# EasyEDA Pro project YuriPre.eprj

# Schematic PCB_PCB_A100C_2 copy_2022-05-16/SCH_103c6t6a_YoriPre_2022-05-16

## Sheets
1 MAIN_PART
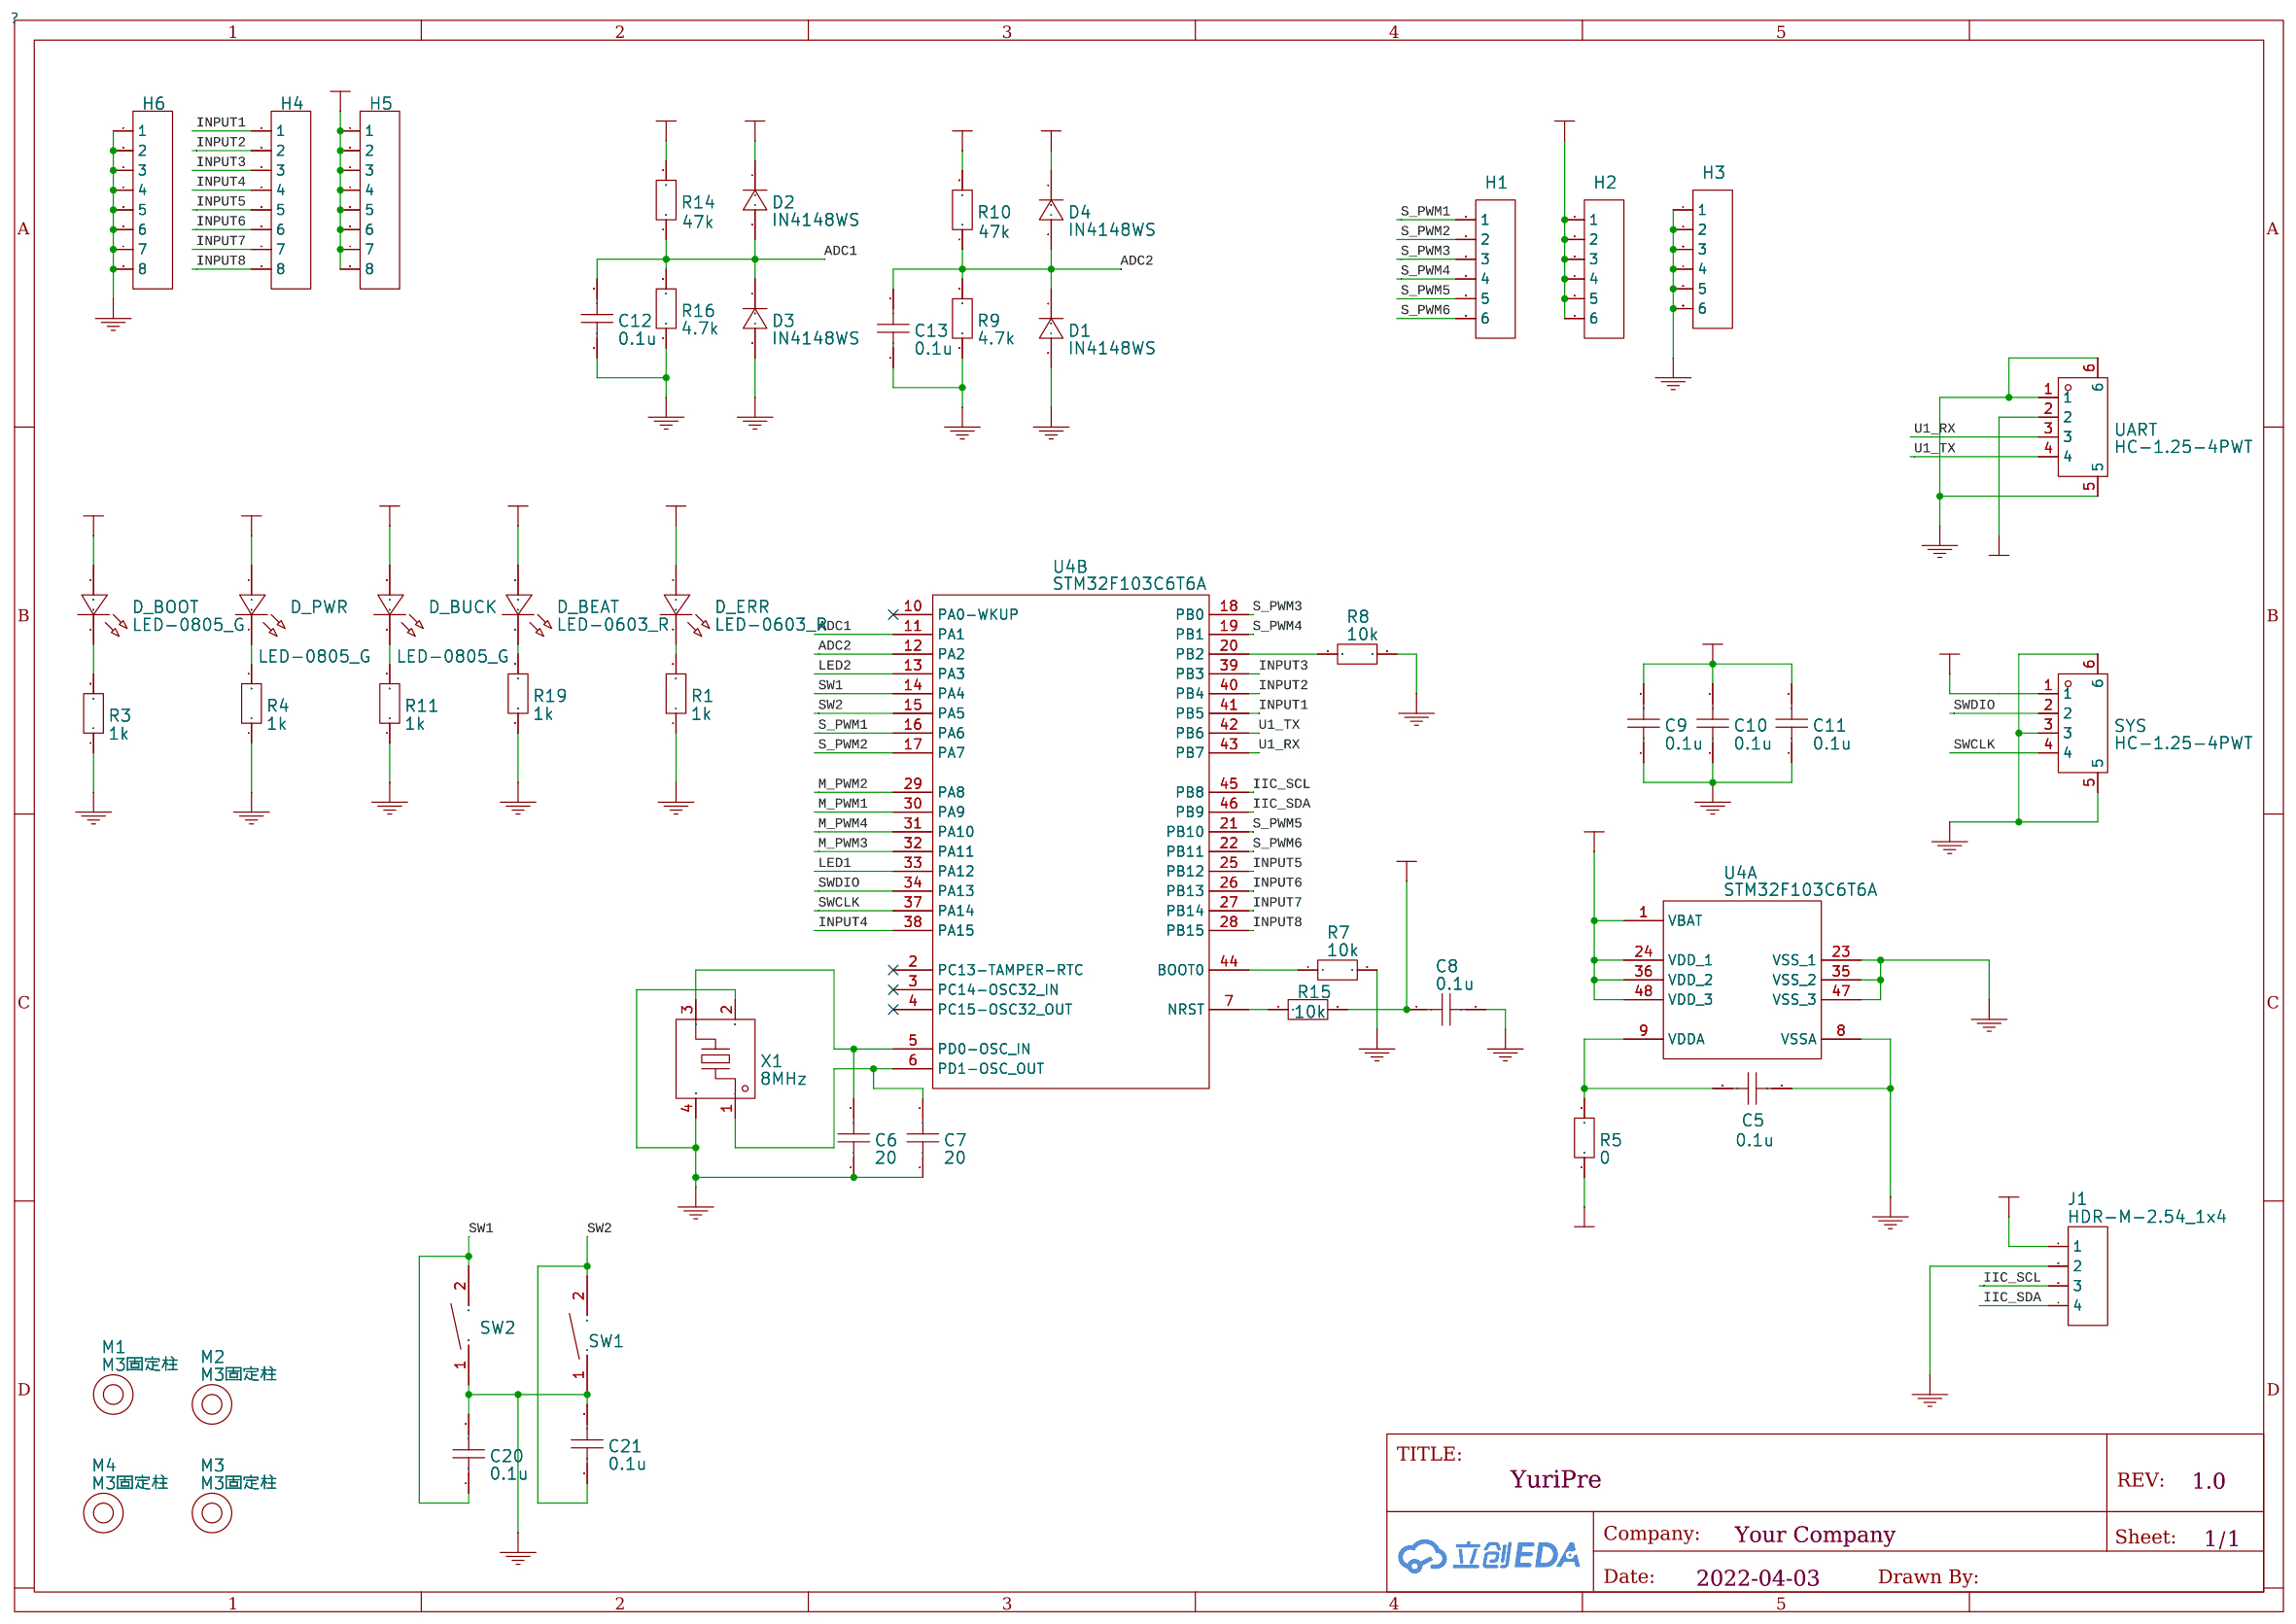
[diagram p0: MAIN_PART]
2 PWR_PART
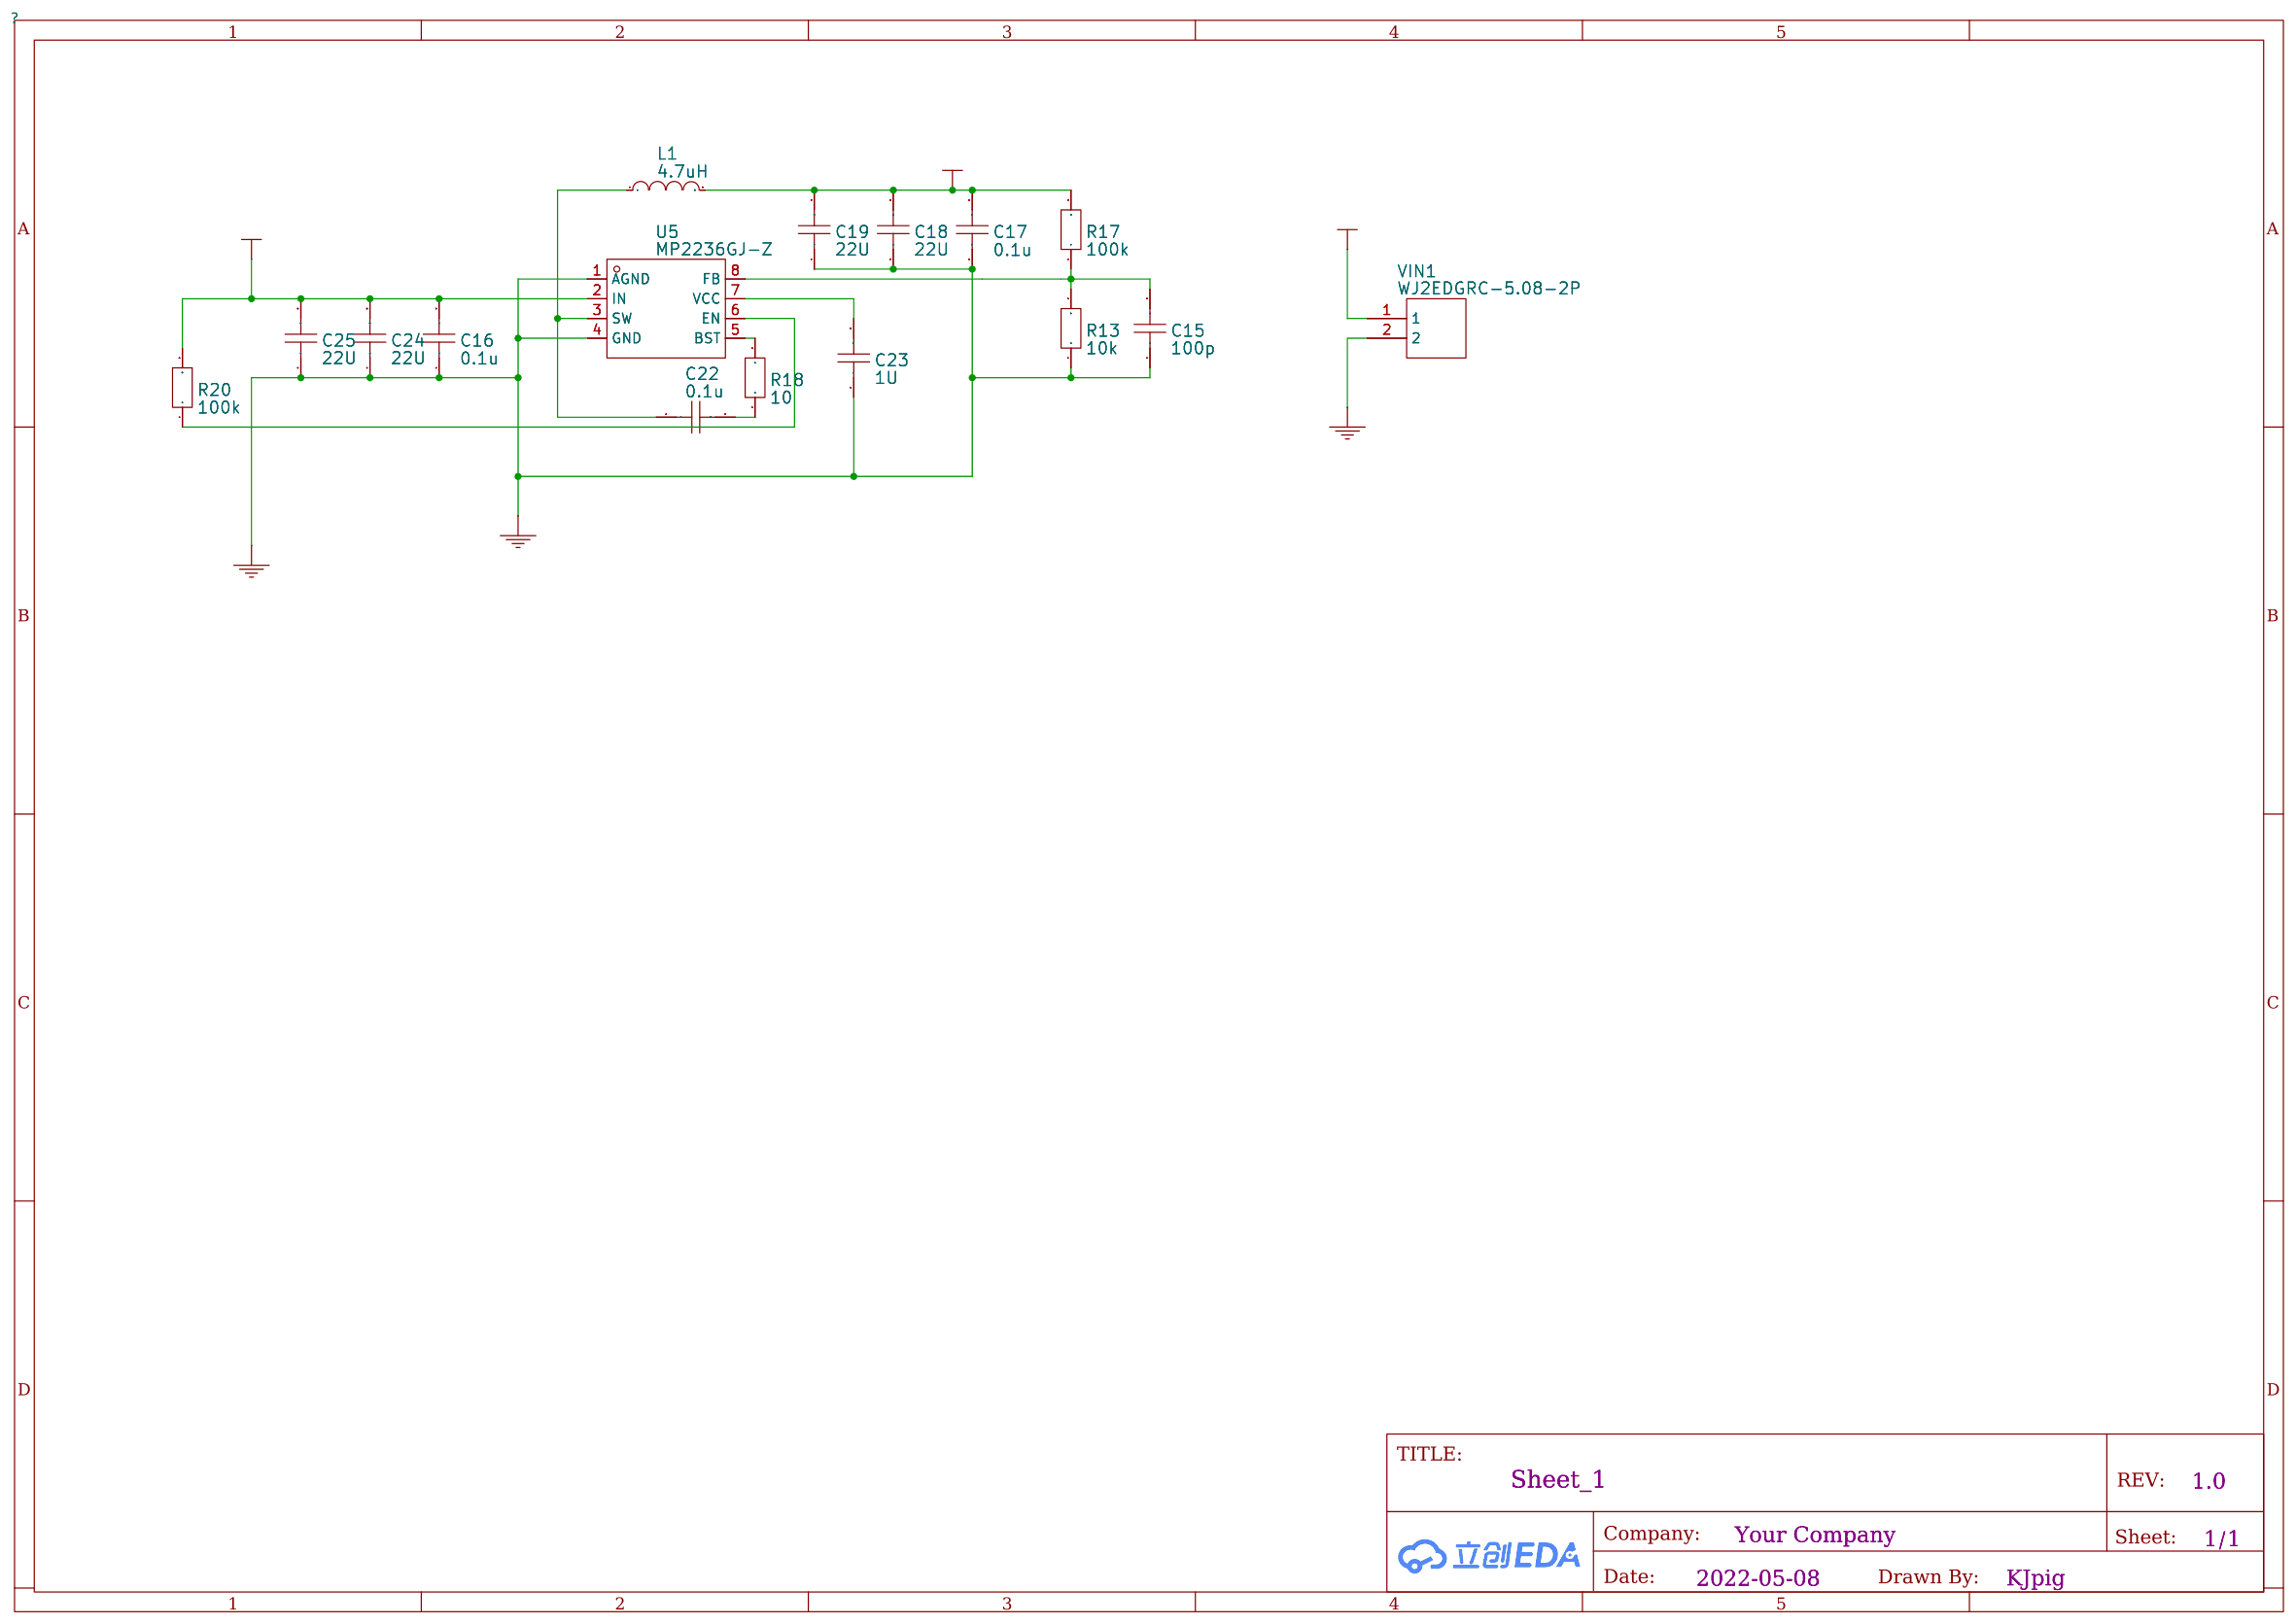
[diagram p1: PWR_PART]
3 MOTOR_PART
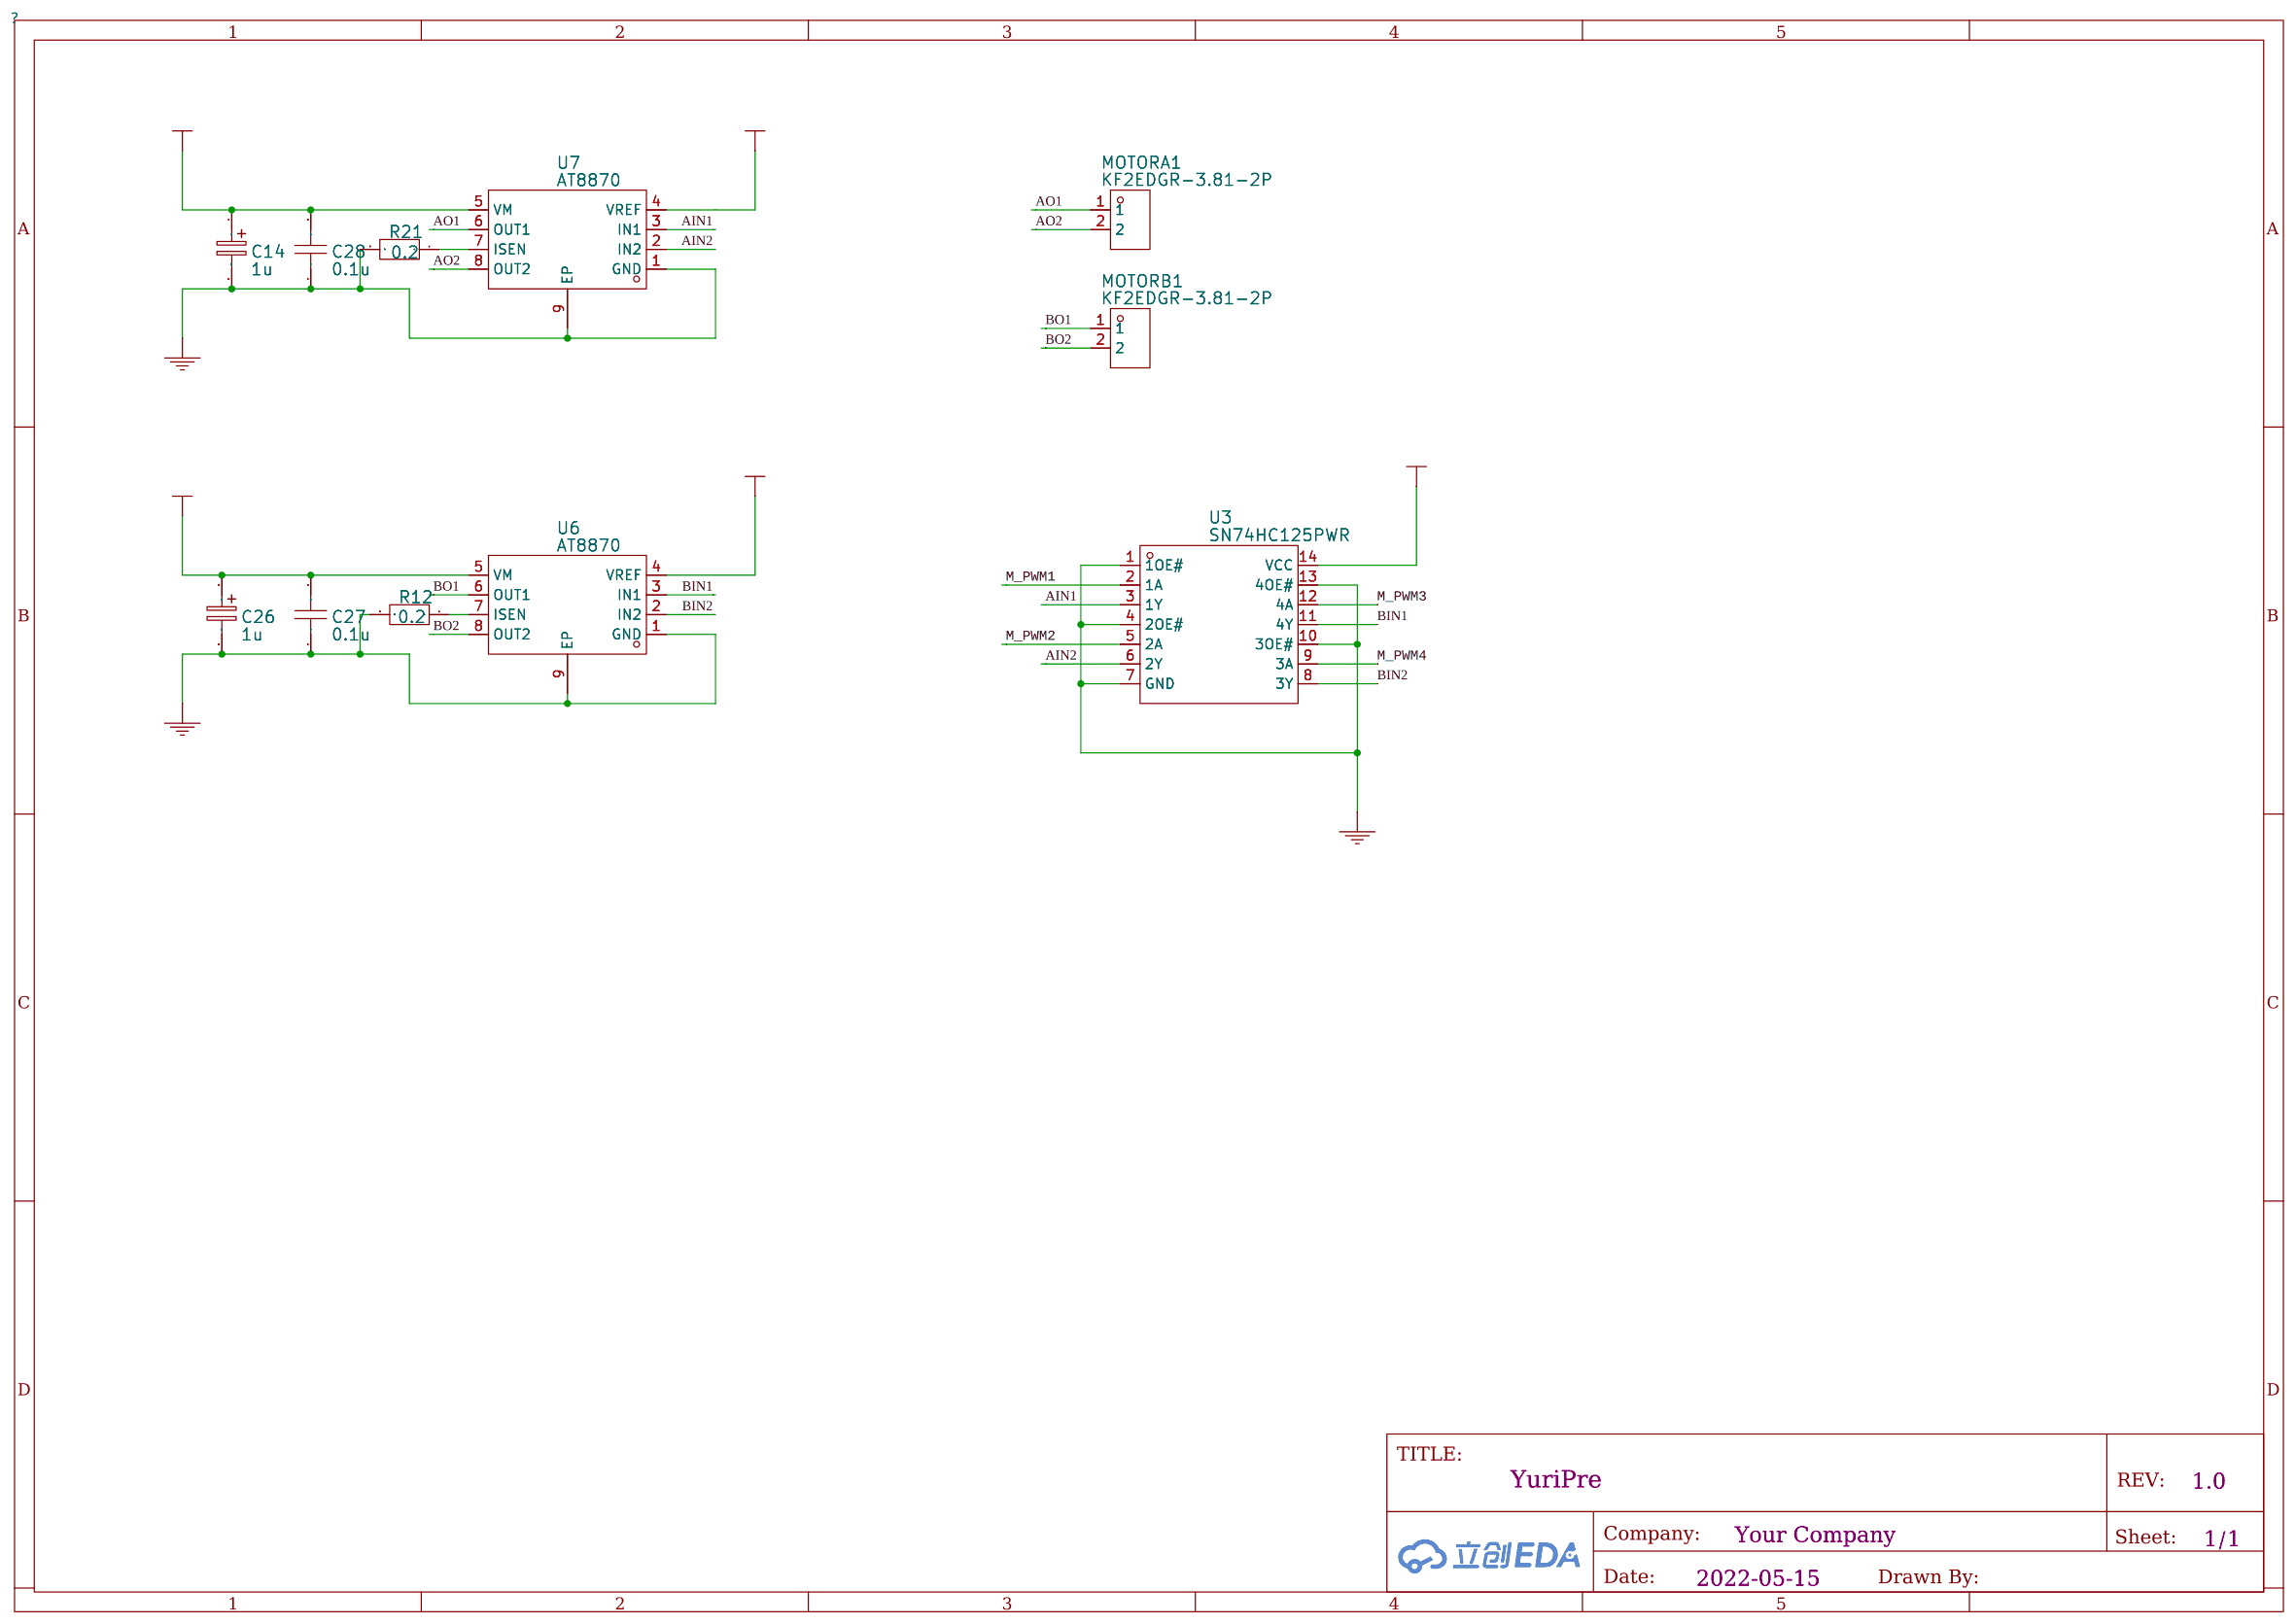
[diagram p2: MOTOR_PART]

## Parts
sheet MAIN_PART
C5  0.1u  [C0603]
C6  20  [C0603]
C7  20  [C0603]
C8  0.1u  [C0603]
C9  0.1u  [C0603]
C10  0.1u  [C0603]
C11  0.1u  [C0603]
C12  0.1u  [C0603]
C13  0.1u  [C0603]
C20  0.1u  [C0603]
C21  0.1u  [C0603]
D1  IN4148WS  [SOD-323_L1.8-W1.3-LS2.5-RD]
D2  IN4148WS  [SOD-323_L1.8-W1.3-LS2.5-RD]
D3  IN4148WS  [SOD-323_L1.8-W1.3-LS2.5-RD]
D4  IN4148WS  [SOD-323_L1.8-W1.3-LS2.5-RD]
D_BEAT  LED-0603_R  [LED0603_RED]
D_BOOT  LED-0805_G  [LED0805_GREEN]
D_BUCK  LED-0805_G  [LED0805_GREEN]
D_ERR  LED-0603_R  [LED0603_RED]
D_PWR  LED-0805_G  [LED0805_GREEN]
H1  HDR-F-2.54_1x6  [HDR-F-2.54_1X6]
H2  HDR-F-2.54_1x6  [HDR-F-2.54_1X6]
H3  HDR-F-2.54_1x6  [HDR-F-2.54_1X6]
H4  HDR-F-2.54_1x8  [HDR-F-2.54_1X8]
H5  HDR-F-2.54_1x8  [HDR-F-2.54_1X8]
H6  HDR-F-2.54_1x8  [HDR-F-2.54_1X8]
J1  HDR-M-2.54_1x4  [HDR-M-2.54_1X4]
M1  M3固定柱  [M3螺丝孔外直径6MM-带8小孔]
M2  M3固定柱  [M3螺丝孔外直径6MM-带8小孔]
M3  M3固定柱  [M3螺丝孔外直径6MM-带8小孔]
M4  M3固定柱  [M3螺丝孔外直径6MM-带8小孔]
R1  1k  [R0603]
R3  1k  [R0603]
R4  1k  [R0603]
R5  0  [R0603]
R7  10k  [R0603]
R8  10k  [R0603]
R9  4.7k  [R0603]
R10  47k  [R0603]
R11  1k  [R0603]
R14  47k  [R0603]
R15  10k  [R0603]
R16  4.7k  [R0603]
R19  1k  [R0603]
SW1  TSA343G00D-250J2  [SW-SMD_L4.0-W2.9-P4.15-EH]
SW2  TSA343G00D-250J2  [SW-SMD_L4.0-W2.9-P4.15-EH]
SYS  HC-1.25-4PWT  [CONN-SMD_4P-P1.25-HC-1.25-4PWT]
U4  STM32F103C6T6A  [LQFP-48_L7.0-W7.0-P0.50-LS9.0-BL]  (sections 1,2)
UART  HC-1.25-4PWT  [CONN-SMD_4P-P1.25-HC-1.25-4PWT]
X1  8MHz  [CRYSTAL-SMD_4P-L3.2-W2.5-BL]
sheet MOTOR_PART
C14  1u  [CAP-D6.3×H5.5]
C26  1u  [CAP-D6.3×H5.5]
C27  0.1u  [C0603]
C28  0.1u  [C0603]
MOTORA1  KF2EDGR-3.81-2P  [CONN-TH_2P-P3.81_KF2EDGR-3.81-2P]
MOTORB1  KF2EDGR-3.81-2P  [CONN-TH_2P-P3.81_KF2EDGR-3.81-2P]
R12  0.2  [R0603]
R21  0.2  [R0603]
U3  SN74HC125PWR  [TSSOP-14_L5.0-W4.4-P0.65-LS6.5-BL]
U6  AT8870  [SO-8_L4.9-W3.9-P1.27-LS6.0-BL-EP]
U7  AT8870  [SO-8_L4.9-W3.9-P1.27-LS6.0-BL-EP]
sheet PWR_PART
C15  100p  [C0603]
C16  0.1u  [C0603]
C17  0.1u  [C0603]
C18  22U  [C0805]
C19  22U  [C0805]
C22  0.1u  [C0603]
C23  1U  [C0603]
C24  22U  [C0805]
C25  22U  [C0805]
L1  4.7uH  [IND-SMD_L7.1-W6.5]
R13  10k  [R0603]
R17  100k  [R0603]
R18  10  [R0603]
R20  100k  [R0603]
U5  MP2236GJ-Z  [TSOT-23-8_L2.9-W1.6-P0.65-LS2.8-BL]
VIN1  WJ2EDGRC-5.08-2P  [CONN-TH_2P-P5.08_WJ2EDGRC-5.08-2P]

## Library data of the parts
C5 C8-C13 C16 C17 C20-C22 C27 C28 = 0.1u
C6 C7 = 20
D1-D4 = IN4148WS: Supplier: LCSC; Supplier Part: C417545; Manufacturer: Leshan Radio; JLCPCB Part Class: Extended Part
D_BEAT D_ERR = LED-0603_R: Manufacturer: EVERLIGHT(台湾亿光); Manufacturer Part: 19-217/R6C-AL1M2VY/3T; Supplier Part: C72044; Supplier: LCSC
D_BOOT D_BUCK D_PWR = LED-0805_G: Manufacturer: 国星光电; Manufacturer Part: NCD0805G1; Supplier Part: C84260
H1-H3 = HDR-F-2.54_1x6: Supplier Part: C40877; Supplier: LCSC
H4-H6 = HDR-F-2.54_1x8: Supplier Part: C225505; Supplier: LCSC
J1 = HDR-M-2.54_1x4: Supplier Part: C124378; Supplier: LCSC
M1-M4 = M3固定柱
R1 R3 R4 R11 R19 = 1k
R5 = 0_
R7 R8 R13 R15 = 10k
R9 R16 = 4.7k
R10 R14 = 47k
SW1 SW2 = TSA343G00D-250J2: Supplier: LCSC; Supplier Part: C354947; Manufacturer: BRIGHT; JLCPCB Part Class: Extended Part
SYS UART = HC-1.25-4PWT: Supplier: LCSC; Supplier Part: C2845381; Manufacturer: HCTL(华灿天禄); JLCPCB Part Class: Extended Part
U4 = STM32F103C6T6A: tags: STM32; Supplier Part: C8303; Supplier: LCSC; Manufacturer: ST; JLCPCB Part Class: Extended Part
X1 = 8MHz: Supplier: LCSC; Supplier Part: C2682774; Manufacturer: YXC扬兴科技; Manufacturer Part: X32258MSB4SI; JLCPCB Part Class: Extended Part
C14 C26 = 1u
MOTORA1 MOTORB1 = KF2EDGR-3.81-2P: Supplier: LCSC; Supplier Part: C441182; Manufacturer: Cixi Kefa Elec; JLCPCB Part Class: Extended Part
R12 R21 = 0.2
U3 = SN74HC125PWR: Supplier: LCSC; Supplier Part: C132994; Manufacturer: Texas Instruments; JLCPCB Part Class: Extended Part
U6 U7 = AT8870: Supplier: LCSC; Supplier Part: C191458; Manufacturer: Jiaxing Heroic Elec Tech; JLCPCB Part Class: Extended Part
C15 = 100p
C18 C19 C24 C25 = 22U
C23 = 1U
L1 = 4.7uH: Supplier: LCSC; Manufacturer: TDK; Manufacturer Part: SPM6530T-4R7M; Supplier Part: C76857; JLCPCB Part Class: Extended Part
R17 R20 = 100k
R18 = 10
U5 = MP2236GJ-Z: Supplier: LCSC; Supplier Part: C9900000708; Manufacturer: null; JLCPCB Part Class: Extended Part
VIN1 = WJ2EDGRC-5.08-2P: Supplier: LCSC; Manufacturer: ReliaPro; Supplier Part: C3697; JLCPCB Part Class: Extended Part

## Nets
3V3: C8.1 C9.2 C10.2 C11.2 D2.1(C) D4.1(C) D_BEAT.1 D_BOOT.1 D_ERR.1 H5.1 H5.2 H5.3 H5.4 H5.5 H5.6 H5.7 H5.8 J1.1 R5.1 R15.2 SYS.1 U3.14(VCC) U4.1(VBAT) U4.24(VDD_1) U4.36(VDD_2) U4.48(VDD_3) U6.4(VREF) U7.4(VREF) UART.2
+6.8V: C17.2 C18.2 C19.2 D_BUCK.1 H2.1 H2.2 H2.3 H2.4 H2.5 H2.6 L1.2 R10.2 R17.2
GND: C5.2 C6.1 C7.1 C8.2 C9.1 C10.1 C11.1 C12.1 C13.1 C14.2 C15.1 C16.1 C17.1 C18.1 C19.1 C20.2 C21.2 C23.1 C24.1 C25.1 C26.2 C27.1 C28.1 D1.2(A) D3.2(A) H3.1 H3.2 H3.3 H3.4 H3.5 H3.6 H6.1 H6.2 H6.3 H6.4 H6.5 H6.6 H6.7 H6.8 J1.2 R3.1 R4.1 R7.2 R8.2 R9.1 R11.1 R12.2 R13.1 R16.1 R21.2 SW1.1 SW2.1 SYS.3 SYS.5 SYS.6 U3.1(1OE#) U3.4(2OE#) U3.7(GND) U3.10(3OE#) U3.13(4OE#) U4.8(VSSA) U4.23(VSS_1) U4.35(VSS_2) U4.47(VSS_3) U5.1(AGND) U5.4(GND) U6.1(GND) U6.9(EP) U7.1(GND) U7.9(EP) UART.1 UART.5 UART.6 VIN1.2 X1.2(GND) X1.4(GND)
VIN: C14.1 C16.2 C24.2 C25.2 C26.1 C27.2 C28.2 D_PWR.1 R14.2 R20.2 U5.2(IN) U6.5(VM) U7.5(VM) VIN1.1
ADC1: C12.2 D2.2(A) D3.1(C) R14.1 R16.2 U4.11(PA1)
ADC2: C13.2 D1.1(C) D4.2(A) R9.2 R10.1 U4.12(PA2)
AIN1: U3.3(1Y) U7.3(IN1)
AIN2: U3.6(2Y) U7.2(IN2)
AO1: MOTORA1.1 U7.6(OUT1)
AO2: MOTORA1.2 U7.8(OUT2)
BIN1: U3.11(4Y) U6.3(IN1)
BIN2: U3.8(3Y) U6.2(IN2)
BO1: MOTORB1.1 U6.6(OUT1)
BO2: MOTORB1.2 U6.8(OUT2)
IIC_SCL: J1.3 U4.45(PB8)
IIC_SDA: J1.4 U4.46(PB9)
INPUT1: H4.1 U4.41(PB5)
INPUT2: H4.2 U4.40(PB4)
INPUT3: H4.3 U4.39(PB3)
INPUT4: H4.4 U4.38(PA15)
INPUT5: H4.5 U4.25(PB12)
INPUT6: H4.6 U4.26(PB13)
INPUT7: H4.7 U4.27(PB14)
INPUT8: H4.8 U4.28(PB15)
LED1: R19.1 U4.33(PA12)
LED2: R1.1 U4.13(PA3)
M_PWM1: U3.2(1A) U4.30(PA9)
M_PWM2: U3.5(2A) U4.29(PA8)
M_PWM3: U3.12(4A) U4.32(PA11)
M_PWM4: U3.9(3A) U4.31(PA10)
S_PWM1: H1.1 U4.16(PA6)
S_PWM2: H1.2 U4.17(PA7)
S_PWM3: H1.3 U4.18(PB0)
S_PWM4: H1.4 U4.19(PB1)
S_PWM5: H1.5 U4.21(PB10)
S_PWM6: H1.6 U4.22(PB11)
SW1: C20.1 SW2.2 U4.14(PA4)
SW2: C21.1 SW1.2 U4.15(PA5)
SWCLK: SYS.4 U4.37(PA14)
SWDIO: SYS.2 U4.34(PA13)
U1_RX: U4.43(PB7) UART.3
U1_TX: U4.42(PB6) UART.4
$1N129: D_BOOT.2 R3.2
$1N134: D_PWR.2 R4.2
$1N167: C5.1 R5.2 U4.9(VDDA)
$1N215: C7.2 U4.6(PD1-OSC_OUT) X1.1
$1N216: C6.2 U4.5(PD0-OSC_IN) X1.3
$1N257: R7.1 U4.44(BOOT0)
$1N262: R8.1 U4.20(PB2)
$1N295: R15.1 U4.7(NRST)
$1N540: D_BEAT.2 R19.2
$1N717: D_BUCK.2 R11.2
$1N960: D_ERR.2 R1.2
$2N12: C15.2 R13.2 R17.1 U5.8(FB)
$2N96: C22.1 L1.1 U5.3(SW)
$2N110: C22.2 R18.1
$2N111: R18.2 U5.5(BST)
$2N134: C23.2 U5.7(VCC)
$2N158: R20.1 U5.6(EN)
$3N90: R12.1 U6.7(ISEN)
$3N100: R21.1 U7.7(ISEN)

Not connected (* = marked no-connect by the designer): U4 2(PC13-TAMPER-RTC)* 3(PC14-OSC32_IN)* 4(PC15-OSC32_OUT)* 10(PA0-WKUP)*

# Board PCB_PCB_A100C_2 copy_2022-05-16/PCB_PCB_A100C_2 copy_2022-05-16
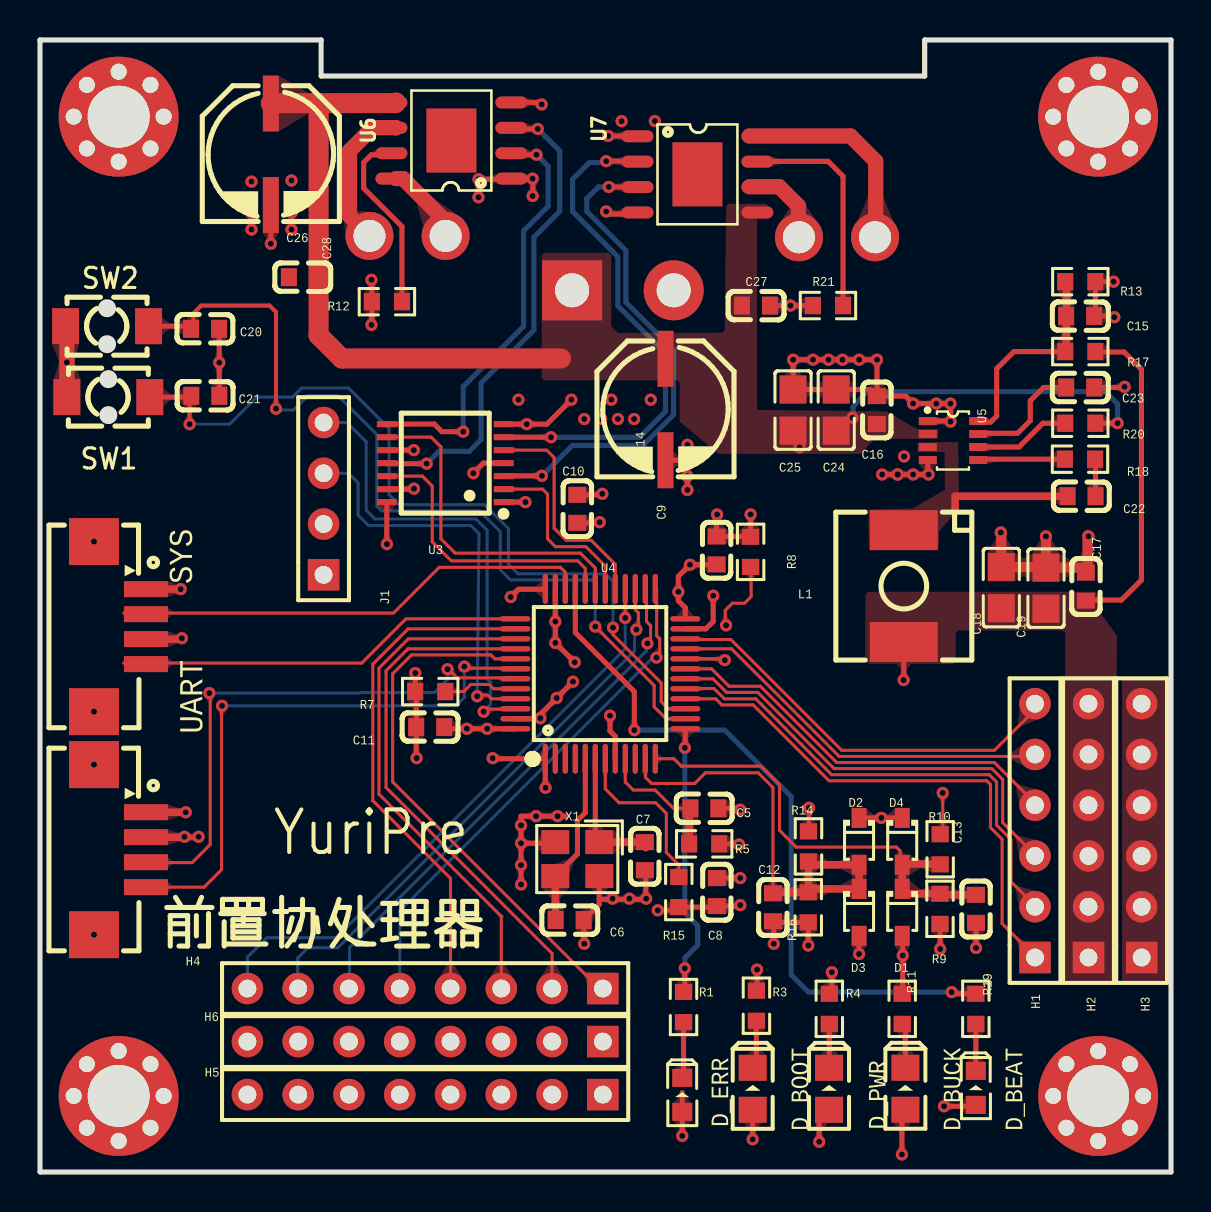
[diagram p3: board, top side]
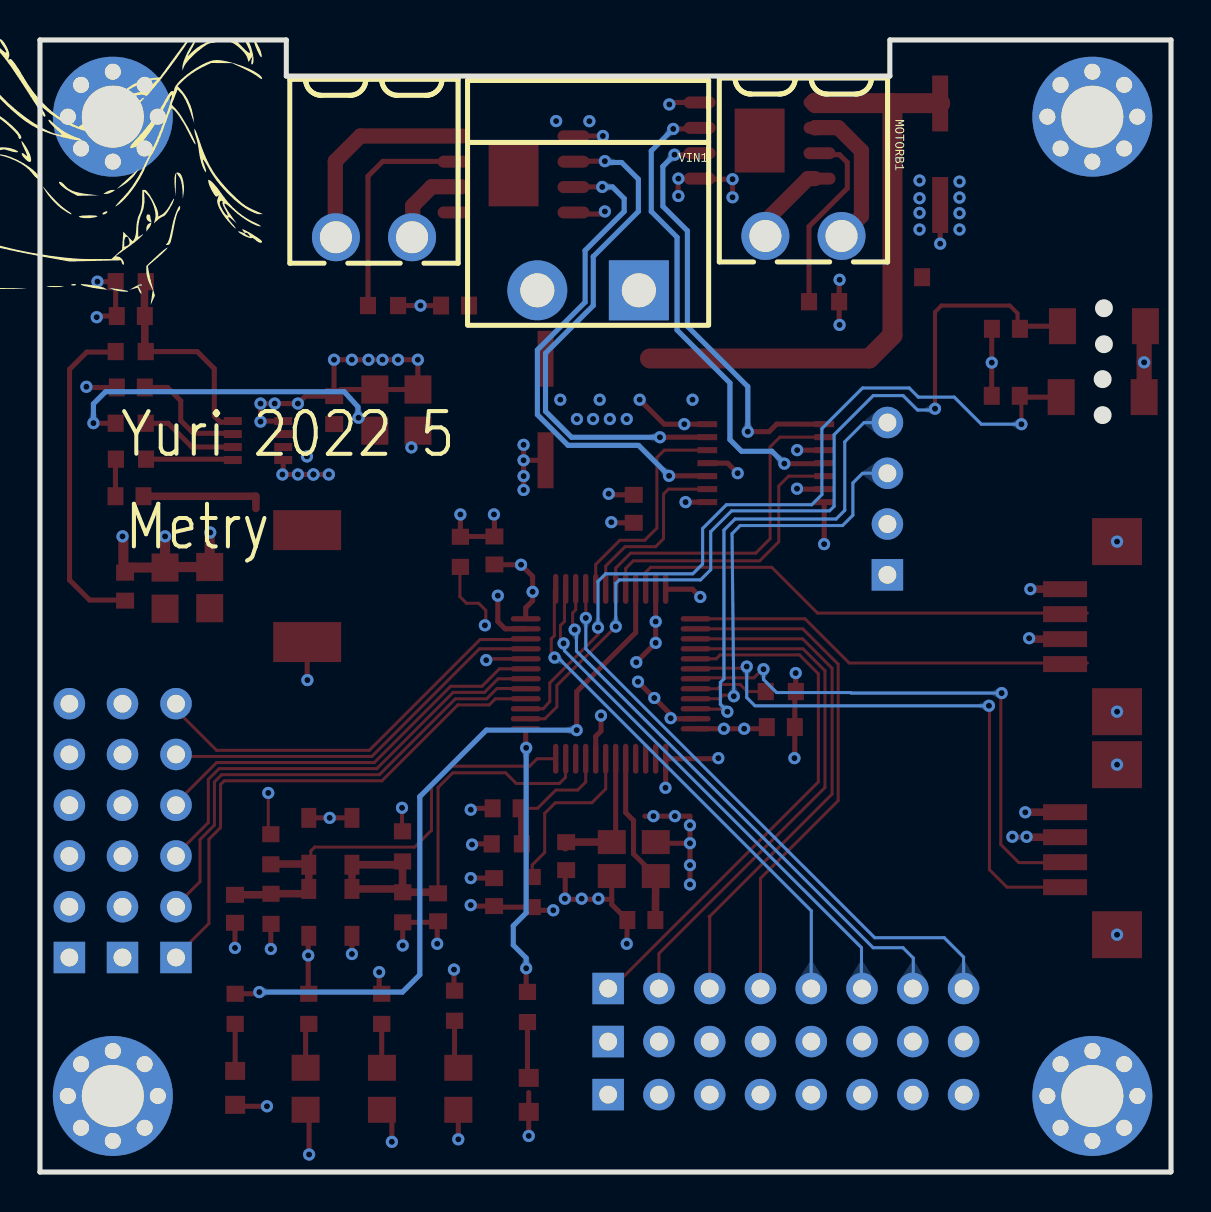
[diagram p4: board, bottom side, seen from below]

Outline 56.58 x 56.64 mm; copper layers: Top Layer, Inner1, Inner2, Bottom Layer. Coordinates in mm from the lower left corner of the outline.
Outline path: 0,56.64 14.06,56.64 14.06,54.84 44.26,54.84 44.26,56.64 56.58,56.64 56.58,0 0.02,0 0,0.02 0,56.64
Stack: Top Layer 0.035mm / Dielectric1 0.48mm PP er 4.5 / Inner1 0.035mm / Dielectric2 0.48mm FR4 er 4.5 / Inner2 0.035mm / Dielectric3 0.48mm PP er 4.5 / Bottom Layer 0.035mm

## Design rules (mm)
spacing Default (default): track to track 0.152, other pairs 0.152 to 0.3
track width Default (default): min 0.152, default 0.152, max 25.4
track width PWD1: min 0.254, default 0.254, max 25.4
track width SINGLE: min 0.152, default 0.152, max 25.4
differential pair differentialPair (default): width min 0.127, default 0.254, max 2.54; gap min 0.152, default 0.152
via Default (default): diameter min 0.61, default 0.61, max 100.025; hole min 0.305, default 0.305, max 59.995
via PWD1: diameter min 0.61, default 0.61, max 100.025; hole min 0.305, default 0.305, max 59.995
via SINGLE: diameter min 0.61, default 0.61, max 100.025; hole min 0.305, default 0.305, max 59.995
net GND uses PWD1, gge10144
net 3V3 uses PWD1, gge8426
net VIN uses gge8870
pour e1008 uses gge10144

## Placement (name value [footprint] x y rotation side)
C5  0.1u  [C0603]  33.24 18.2 0 top
C6  20  [C0603]  26.5 12.61 180 top
C7  20  [C0603]  30.26 15.81 90 top
C8  0.1u  [C0603]  33.86 14.01 90 top
C9  0.1u  [C0603]  33.85 31.1 270 top
C10  0.1u  [C0603]  26.88 33.19 270 top
C11  0.1u  [C0603]  19.52 22.26 0 top
C12  0.1u  [C0603]  36.67 13.25 90 top
C13  0.1u  [C0603]  46.83 13.17 90 top
C14  1u  [CAP-D6.3×H5.5]  31.29 35.61 90 top
C15  100p  [C0603]  52.03 42.83 180 top
C16  0.1u  [C0603]  41.86 38.13 270 top
C17  0.1u  [C0603]  52.32 29.29 270 top
C18  22U  [C0805]  48.09 29.24 270 top
C19  22U  [C0805]  50.33 29.22 270 top
C20  0.1u  [C0603]  8.26 42.19 0 top
C21  0.1u  [C0603]  8.27 38.84 0 top
C22  0.1u  [C0603]  52.1 33.81 0 top
C23  1U  [C0603]  52.03 39.26 180 top
C24  22U  [C0805]  39.83 38.13 270 top
C25  22U  [C0805]  37.67 38.13 270 top
C26  1u  [CAP-D6.3×H5.5]  11.55 48.39 90 top
C27  0.1u  [C0603]  35.82 43.36 180 top
C28  0.1u  [C0603]  13.15 44.77 0 top
D1  IN4148WS  [SOD-323_L1.8-W1.3-LS2.5-RD]  43.13 12.99 270 top
D2  IN4148WS  [SOD-323_L1.8-W1.3-LS2.5-RD]  40.97 16.55 270 top
D3  IN4148WS  [SOD-323_L1.8-W1.3-LS2.5-RD]  40.97 12.99 270 top
D4  IN4148WS  [SOD-323_L1.8-W1.3-LS2.5-RD]  43.13 16.55 270 top
D_BEAT  LED-0603_R  [LED0603_RED]  46.82 4.21 90 top
D_BOOT  LED-0805_G  [LED0805_GREEN]  35.65 4.16 90 top
D_BUCK  LED-0805_G  [LED0805_GREEN]  43.29 4.17 90 top
D_ERR  LED-0603_R  [LED0603_RED]  32.13 3.86 90 top
D_PWR  LED-0805_G  [LED0805_GREEN]  39.47 4.16 90 top
H1  HDR-F-2.54_1x6  [HDR-F-2.54_1X6]  49.78 15.81 90 top
H2  HDR-F-2.54_1x6  [HDR-F-2.54_1X6]  52.45 15.81 90 top
H3  HDR-F-2.54_1x6  [HDR-F-2.54_1X6]  55.11 15.81 90 top
H4  HDR-F-2.54_1x8  [HDR-F-2.54_1X8]  20.54 9.18 180 top
H5  HDR-F-2.54_1x8  [HDR-F-2.54_1X8]  20.54 3.87 180 top
H6  HDR-F-2.54_1x8  [HDR-F-2.54_1X8]  20.54 6.53 180 top
J1  HDR-M-2.54_1x4  [HDR-M-2.54_1X4]  14.19 33.69 90 top
L1  4.7uH  [IND-SMD_L7.1-W6.5]  43.21 29.32 270 top
M1  M3固定柱  [M3螺丝孔外直径6MM-带8小孔]  52.94 52.81 0 top
M2  M3固定柱  [M3螺丝孔外直径6MM-带8小孔]  3.94 3.81 0 top
M3  M3固定柱  [M3螺丝孔外直径6MM-带8小孔]  3.94 52.81 0 top
M4  M3固定柱  [M3螺丝孔外直径6MM-带8小孔]  52.94 3.81 0 top
MOTORA1  KF2EDGR-3.81-2P  [CONN-TH_2P-P3.81_KF2EDGR-3.81-2P]  39.87 46.77 0 bottom
MOTORB1  KF2EDGR-3.81-2P  [CONN-TH_2P-P3.81_KF2EDGR-3.81-2P]  18.39 46.84 0 bottom
R1  1k  [R0603]  32.19 8.26 270 top
R3  1k  [R0603]  35.84 8.32 270 top
R4  1k  [R0603]  39.49 8.17 270 top
R5  0  [R0603]  33.23 16.42 180 top
R7  10k  [R0603]  19.52 24.04 180 top
R8  10k  [R0603]  35.55 31.03 90 top
R9  4.7k  [R0603]  45.02 13.17 90 top
R10  47k  [R0603]  45.03 16.15 90 top
R11  1k  [R0603]  43.13 8.17 270 top
R12  0.2  [R0603]  17.36 43.55 180 top
R13  10k  [R0603]  52.04 44.55 180 top
R14  47k  [R0603]  38.44 16.29 90 top
R15  10k  [R0603]  31.96 14.01 270 top
R16  4.7k  [R0603]  38.43 13.25 90 top
R17  100k  [R0603]  52.04 41.05 0 top
R18  10  [R0603]  52.03 35.67 180 top
R19  1k  [R0603]  46.82 8.17 270 top
R20  100k  [R0603]  52.04 37.47 0 top
R21  0.2  [R0603]  39.42 43.36 180 top
SW1  TSA343G00D-250J2  [SW-SMD_L4.0-W2.9-P4.15-EH]  3.42 38.77 0 top
SW2  TSA343G00D-250J2  [SW-SMD_L4.0-W2.9-P4.15-EH]  3.36 42.32 0 top
SYS  HC-1.25-4PWT  [CONN-SMD_4P-P1.25-HC-1.25-4PWT]  4 27.29 270 top
U3  SN74HC125PWR  [TSSOP-14_L5.0-W4.4-P0.65-LS6.5-BL]  20.27 35.47 90 top
U4  STM32F103C6T6A  [LQFP-48_L7.0-W7.0-P0.50-LS9.0-BL]  28.03 24.93 0 top
U5  MP2236GJ-Z  [TSOT-23-8_L2.9-W1.6-P0.65-LS2.8-BL]  45.67 36.6 270 top
U6  AT8870  [SO-8_L4.9-W3.9-P1.27-LS6.0-BL-EP]  20.58 51.61 90 top
U7  AT8870  [SO-8_L4.9-W3.9-P1.27-LS6.0-BL-EP]  32.89 49.92 270 top
UART  HC-1.25-4PWT  [CONN-SMD_4P-P1.25-HC-1.25-4PWT]  4 16.13 270 top
VIN1  WJ2EDGRC-5.08-2P  [CONN-TH_2P-P5.08_WJ2EDGRC-5.08-2P]  29.16 44.12 0 bottom
X1  8MHz  [CRYSTAL-SMD_4P-L3.2-W2.5-BL]  26.88 15.66 180 top

## Footprints (pads in the part's own frame, mm; a bottom-side part is the same pattern mirrored in y, then rotated)
C0603
  rect 0.8x0.9 smd: 1(-0.7,0) 2(0.7,0)
C0805
  rect 1.41x1.35 smd: 1(-1.03,0) 2(1.03,0)
CAP-D6.3×H5.5
  rect 2.8x0.8 smd: 1(5.08,0) 2(0,0)
CONN-SMD_4P-P1.25-HC-1.25-4PWT
  rect 0.8x2.2 smd: 1(-1.875,1.3) 2(-0.625,1.3) 3(0.625,1.3) 4(1.875,1.3)
  rect 2.35x2.5 smd: 5(4.255,-1.3) 6(-4.255,-1.3)
CONN-TH_2P-P3.81_KF2EDGR-3.81-2P
  round 2.4 hole 1.6: 1(-1.905,0) 2(1.905,0)
CONN-TH_2P-P5.08_WJ2EDGRC-5.08-2P
  rect 3x3 hole 1.7: 1(-2.54,0)
  round 3 hole 1.7: 2(2.54,0)
CRYSTAL-SMD_4P-L3.2-W2.5-BL
  rect 1.4x1.2 smd: 1(-1.1,-0.85) 2(1.1,-0.85) 3(1.1,0.85) 4(-1.1,0.85)
HDR-F-2.54_1X6
  rect 1.575x1.575 hole 0.889: 1(-5.08,0)
  round 1.575 hole 0.889: 2(-2.54,0) 3(0,0) 4(2.54,0) 5(5.08,0) 6(7.62,0)
HDR-F-2.54_1X8
  rect 1.575x1.575 hole 0.889: 1(-7.62,0)
  round 1.575 hole 0.889: 2(-5.08,0) 3(-2.54,0) 4(0,0) 5(2.54,0) 6(5.08,0) 7(7.62,0) 8(10.16,0)
HDR-M-2.54_1X4
  rect 1.575x1.575 hole 0.889: 1(-3.81,0)
  round 1.575 hole 0.889: 2(-1.27,0) 3(1.27,0) 4(3.81,0)
IND-SMD_L7.1-W6.5
  rect 2x3.4 smd: 1(-2.8,0) 2(2.8,0)
LED0603_RED
  rect 0.9x1 smd: 1(-0.85,0) 2(0.85,0)
LED0805_GREEN
  rect 1.3x1.399 smd: 1(-1.05,0) 2(1.05,0)
LQFP-48_L7.0-W7.0-P0.50-LS9.0-BL
  oval 0.27x1.5 smd: 1(-2.75,-4.25) 2(-2.25,-4.25) 3(-1.75,-4.25) 4(-1.25,-4.25) 5(-0.75,-4.25) 6(-0.25,-4.25) 7(0.25,-4.25) 8(0.75,-4.25) 9(1.25,-4.25) 10(1.75,-4.25) 11(2.25,-4.25) 12(2.75,-4.25) 25(2.75,4.25) 26(2.25,4.25) 27(1.75,4.25) 28(1.25,4.25) 29(0.75,4.25) 30(0.25,4.25) 31(-0.25,4.25) 32(-0.75,4.25) 33(-1.25,4.25) 34(-1.75,4.25) 35(-2.25,4.25) 36(-2.75,4.25)
  oval 1.5x0.27 smd: 13(4.25,-2.75) 14(4.25,-2.25) 15(4.25,-1.75) 16(4.25,-1.25) 17(4.25,-0.75) 18(4.25,-0.25) 19(4.25,0.25) 20(4.25,0.75) 21(4.25,1.25) 22(4.25,1.75) 23(4.25,2.25) 24(4.25,2.75) 37(-4.25,2.75) 38(-4.25,2.25) 39(-4.25,1.75) 40(-4.25,1.25) 41(-4.25,0.75) 42(-4.25,0.25) 43(-4.25,-0.25) 44(-4.25,-0.75) 45(-4.25,-1.25) 46(-4.25,-1.75) 47(-4.25,-2.25) 48(-4.25,-2.75)
M3螺丝孔外直径6MM-带8小孔
  round 0.8 hole 0.8: 1(-2.25,0) 1(-1.591,1.591) 1(-1.591,-1.591) 1(0,2.25) 1(0,-2.25) 1(1.591,1.591) 1(1.591,-1.591) 1(2.25,0)
  round 6 hole 3.1: 1(0,0)
R0603
  rect 0.806x0.864 smd: 1(-0.753,0) 2(0.753,0)
SO-8_L4.9-W3.9-P1.27-LS6.0-BL-EP
  oval 0.6x1.6 smd: 1(-1.905,-2.999) 2(-0.635,-2.999) 3(0.635,-2.999) 4(1.905,-2.999) 5(1.905,2.999) 6(0.635,2.999) 7(-0.635,2.999) 8(-1.905,2.999)
  rect 3.2x2.499 smd: 9(0,0)
SOD-323_L1.8-W1.3-LS2.5-RD
  rect 1x0.75 smd: 1(-1.173,0) 2(1.173,0)
SW-SMD_L4.0-W2.9-P4.15-EH
  rect 1.35x1.8 smd: 1(-2.075,0) 2(2.075,0)
TSOT-23-8_L2.9-W1.6-P0.65-LS2.8-BL
  rect 0.4x0.9 smd: 1(-0.975,-1.26) 2(-0.325,-1.26) 3(0.325,-1.26) 4(0.975,-1.26) 5(0.975,1.26) 6(0.325,1.26) 7(-0.325,1.26) 8(-0.975,1.26)
TSSOP-14_L5.0-W4.4-P0.65-LS6.5-BL
  rect 0.305x0.991 smd: 1(-1.95,-2.925) 2(-1.3,-2.925) 3(-0.65,-2.925) 4(0,-2.925) 5(0.65,-2.925) 6(1.3,-2.925) 7(1.95,-2.925) 8(1.95,2.925) 9(1.3,2.925) 10(0.65,2.925) 11(0,2.925) 12(-0.65,2.925) 13(-1.3,2.925) 14(-1.95,2.925)

## Nets
As in the schematic.

Pads without a net: M1 1; M2 1; M3 1; M4 1; U4 2 3 4 10

## Via types
v1: diameter 0.61, hole 0.305, Top Layer to Bottom Layer, 156 vias

## Routing (per net, layer and track width the routed paths; a pad name or vN(x,y) marks a point on that pad's centre or on a via; arc(x,y) is an arc through that point)
3V3: length 56.7
  Top Layer w0.254: 17.36,31.36 17.36,31.55 17.35,31.56 U3.14 ; D_BEAT.1 46.75,3.29 v1(45.23,3.29) ; D2.1 v1(42.09,17.72) D4.1 ; 35.68,1.61 v1(35.65,1.64) D_BOOT.1 ; v1(28,32.52) 27.97,32.48 C10.2 ; v1(25.1,53.42) 25,53.52 23.35,53.52 ; v1(34.97,16.39) 34.93,16.42 33.98,16.42 ; v1(22.64,20.71) 22.67,20.68 U4.1 25.28,19.24 v1(25.29,19.23) ; C9.2 33.83,30.39 v1(32.52,30.39) 31.94,29.81 v1(31.94,29.03) 31.94,28.58 32.28,28.24 U4.24 ; v1(7.23,16.77) 7.25,16.75 7.96,16.75 v1(7.94,16.77) ; v1(28.32,48.06) 28.45,47.94 29.84,47.94 29.94,48.03 ; v1(32.13,1.81) D_ERR.1 32.13,3.98 ; v1(30.9,13.1) 31.8,13.1 R15.2 33.81,13.25 C8.1 34.99,13.31 v1(35.03,13.36) ; v1(23.55,28.77) 23.94,29.16 25.26,29.16 U4.36 ; C11.2 20.3,22.18 v1(21.35,22.18) v1(22.37,22.18) U4.48
  Top Layer w0.381: 7.36,16.77 v1(7.23,16.77) 7.21,16.75 UART.2 ; SYS.1 v1(7.04,29.17) 7.1,29.23
  Inner2 w0.254: 25.74,48.45 25.74,52.77 v1(25.1,53.42) ; 25.74,48.45 23.94,46.64 v1(23.94,38.64) ; 25.74,48.45 27.94,48.45 v1(28.32,48.06)
  vias: v1(17.36,31.42)
+6.8V: length 53.7
  Top Layer w0.152: 45.03,16.9 45.16,17.03 v1(45.16,18.97)
  Top Layer w0.254: R17.2 52.82,41.03 54.24,41.03 55.1,40.16 55.1,29.62 54.09,28.62 52.41,28.62 ; v1(43.2,24.62) 43.21,24.63 43.21,26.52 ; v1(43.12,0.88) 43.12,3.1 43.13,3.11
  Inner2 w0.254: v1(43.2,24.62) 43.2,20.73 45.1,18.84 45.16,18.9 v1(45.16,18.97) 46,18.97 48.12,16.85 48.12,1.71 47.26,0.85 43.14,0.85 v1(43.12,0.88)
GND: length 124.6
  Top Layer w0.254: 29.94,51.84 v1(28.42,51.84) 28.39,51.81 ; X1.4 27.98,13.64 ; 27.98,13.64 30.29,13.64 v1(30.32,13.68) ; 27.98,13.64 27.98,13.39 C6.1 27.23,11.48 ; v1(24.06,16.45) v1(24.06,15.36) v1(24.06,14.39) 24,14.32 ; v1(24.06,16.45) v1(24.06,17.35) 24.06,17.81 v1(24.82,17.81) v1(25.89,17.81) 26.32,17.81 ; v1(24.06,16.45) 25.72,16.45 25.78,16.51 ; 24.32,33.48 v1(24.29,33.52) U3.1 ; U4.8 28.78,21.8 28.52,22.06 v1(28.52,22.84) ; 18.82,20.73 v1(18.84,20.71) 18.82,20.64 18.82,20.73 ; 18.82,20.73 C11.1 18.82,23.99 R7.2 18.77,24.05 v1(18.77,24.97) ; 27.23,11.45 v1(27.23,11.42) 27.13,11.52 27.23,11.48 ; 27.23,11.45 27.23,11.48 ; 27.23,11.45 27.23,11.48 ; R11.1 43.16,8.95 v1(43.16,10.84) 43.16,11.79 D1.2 ; 24.66,49.69 24.66,48.85 v1(24.64,48.84) ; 24.66,49.69 24.61,49.71 23.35,49.71 23.32,49.68 v1(21.94,49.68) v1(21.94,48.77) ; 24.66,49.69 v1(24.64,49.71) ; v1(16.58,44.64) 16.6,44.62 R12.2 16.6,42.6 16.58,42.58 v1(16.58,42.39) ; U3.4 22.18,35.47 v1(21.68,34.97) ; D3.2 v1(40.97,10.91) 40.97,10.9 ; v1(28.13,33.94) 28.08,33.89 C10.1 ; U5.1 45.52,37.58 v1(45.55,37.55) v1(45.55,38.45) v1(44.84,38.45) 44.77,38.39 44.71,38.45 v1(43.68,38.45) 43.3,38.83 C16.1 ; 30.31,14.83 30.31,13.82 30.32,13.81 30.32,13.61 ; C16.1 41.53,39.16 C24.1 C25.1 37.68,39.16 v1(37.68,40.64) v1(38.67,40.64) v1(39.45,40.64) v1(40.15,40.64) v1(40.98,40.64) v1(41.87,40.64) 41.87,38.83 C16.1 ; v1(45.03,11.16) 45.03,12.41 R9.1 ; v1(32.39,34.13) v1(32.39,34.82) v1(32.39,35.61) ; 52.73,39.26 54.1,39.26 54.13,39.23 ; R21.2 v1(37.55,43.36) C27.1 ; R8.2 v1(35.55,32.9) ; v1(33.68,28.84) 33.68,27.55 33.31,27.18 U4.23 ; 11.61,46.39 v1(11.55,46.45) C26.2 ; 36.71,12.5 v1(36.71,11.42) ; 36.71,12.5 36.72,12.49 R16.1 v1(38.43,11.34) 38.39,11.29 ; 36.71,12.5 C12.1 ; v1(18.71,34.19) 18.69,34.17 U3.13 ; C13.1 v1(46.83,11.21) 46.77,11.16 ; C21.2 v1(8.97,40.5) 8.97,42.18 C20.2 ; v1(26.58,38.64) 25.36,37.42 v1(24.35,37.42) U3.7 ; v1(35.03,18.13) 34.96,18.2 C5.2 ; v1(35.87,10.13) 35.87,9.11 R3.1 ; U5.4 44.41,34.94 v1(44.45,34.9) v1(43.68,34.9) v1(42.9,34.9) v1(42.13,34.9) ; C14.2 v1(32.39,35.61) ; v1(32.39,35.61) v1(32.39,36.39) ; v1(26.66,24.53) v1(25.85,23.72) 25.03,22.9 v1(25.03,22.71) 25,22.68 U4.47 ; 53.74,44.52 v1(53.71,44.55) R13.1 52.8,42.89 52.73,42.83 53.68,42.83 v1(53.74,42.77) ; v1(33.87,32.9) 33.85,32.88 C9.1 35.32,31.8 35.57,31.55 ; U3.10 v1(18.7,36.12) 18.71,36.13 ; R4.1 39.61,9.05 v1(39.61,10) ; C8.2 v1(35.03,14.71) ; U4.35 v1(25.78,27.54) v1(25.78,26.48) v1(26.75,25.51)
  Top Layer w0.381: v1(7.1,26.71) 7.05,26.67 5.3,26.67 ; UART.1 7.29,18 v1(7.29,18)
  Top Layer w0.508: 50.33,31.74 50.33,31.81 50.32,31.74 50.33,31.74 ; 50.33,31.74 C19.1 ; v1(52.45,31.81) 52.41,31.85 52.41,30.02 52.18,30.25 C19.1 ; C19.1 50.3,30.27 C18.1 48.09,31.97 v1(48.06,32)
  Top Layer w0.762: SW1.1 v1(1.34,40.51) 1.34,42.26 SW2.1
  vias: v1(2.7,31.55) v1(2.7,23.04) v1(2.7,20.38) v1(2.7,11.87) v1(10.58,49.56) v1(10.58,48.76) v1(10.58,47.98) v1(10.58,47.16) v1(12.58,49.61) v1(12.58,48.73) v1(12.58,47.99) v1(12.58,47.16) v1(27.23,37.68) v1(28.07,37.68) v1(28.58,38.64) v1(28.64,13.68) v1(28.91,37.68) v1(29.1,52.58) v1(29.48,13.68) v1(29.72,37.68) v1(30.55,38.64) v1(30.76,52.59) v1(43.23,35.81) v1(50.32,31.81) v1(54.26,39.29)
VIN: length 102.3
  Top Layer w0.203: v1(38.47,18.22) 38.47,17.07 38.44,17.05
  Top Layer w0.254: 38.94,3.11 38.98,3.08 v1(38.98,1.51) ; R20.2 53.9,37.47 v1(53.91,37.47)
  Top Layer w1: 13.94,53.48 17.77,53.48 17.81,53.52 ; 13.94,53.48 13.94,41.87 15.1,40.71 26.06,40.71 ; 13.94,53.48 11.57,53.48 C26.1
  Inner2 w0.254: 38.58,19.19 38.47,19.08 v1(38.47,18.22) 38.49,18.25 ; 38.58,19.19 37.7,19.19 37.12,19.77 37.12,31.71 37.97,32.56 37.97,36.22 v1(38,36.26) ; 38.58,19.19 43.91,19.19 47.72,15.38 47.72,2.2 47.03,1.51 v1(38.98,1.51)
  Bottom Layer w0.254: v1(40.64,37.74) 40.67,37.77 40.67,38.28 41.36,39.05 53.3,39.05 53.91,38.44 v1(53.91,37.47)
ADC1: length 23
  Top Layer w0.152: C12.2 36.67,19.24 35.93,19.98 33.29,19.98 32.75,19.44 30.6,19.44 30.29,19.75 U4.11
  Top Layer w0.381: 38.44,14.01 38.43,14 36.72,14 C12.2 ; 38.44,14.01 38.6,14.17 40.97,14.17 D2.2 38.61,15.37 R14.1 38.44,14.01
ADC2: length 23.2
  Top Layer w0.152: U4.12 31.71,20.68 32.08,20.31 36.07,20.31 37,19.38 37,17.1 37.83,16.26 42.84,16.26 43.03,16.06 43.03,15.48 D4.2
  Top Layer w0.381: C13.2 45.08,13.87 45.02,13.92 43.37,13.92 43.13,14.17 D4.2 43.17,15.41 45.04,15.41
AIN1: length 25.2
  Top Layer w0.254: 23.2,34.82 23.21,34.84 v1(25.11,34.84) ; v1(28.45,49.29) 29.93,49.29 29.94,49.3
  Bottom Layer w0.254: v1(25.11,34.84) 26.63,36.36 30.16,36.36 31.7,37.9 31.7,41.14 29.31,43.52 29.31,46.11 27.36,48.06 27.36,48.71 27.94,49.29 v1(28.45,49.29)
AIN2: length 25.8
  Top Layer w0.254: 23.2,36.77 v1(25.57,36.77) ; 29.94,50.57 29.93,50.58 v1(28.32,50.58)
  Bottom Layer w0.254: v1(28.32,50.58) 28.26,50.52 27.48,50.52 26.64,49.68 26.64,48.06 28.9,45.81 28.9,43.36 31.29,40.97 31.29,38.06 29.99,36.77 v1(25.57,36.77)
AO1: length 4.6
  Top Layer w0.762: 38.48,46.84 37.94,47.39 37.94,48.35 36.98,49.3 35.48,49.3
AO2: length 10.8
  Top Layer w0.762: 42.29,46.84 41.81,47.32 41.81,50.58 40.55,51.84 35.48,51.84
BIN1: length 24.4
  Top Layer w0.254: U3.11 17.37,35.45 v1(19.34,35.45) ; v1(24.9,52.19) 23.41,52.19 23.35,52.25
  Bottom Layer w0.254: v1(24.9,52.19) 26,51.1 26,48.06 24.71,46.77 24.71,42.13 22.06,39.48 22.06,36.64 21.48,36.06 19.96,36.06 v1(19.34,35.45)
BIN2: length 21.3
  Top Layer w0.254: 17.35,37.42 19.72,37.43 20.11,37.05 v1(21.17,37.05) ; 23.35,50.98 23.43,50.9 v1(24.84,50.9)
  Bottom Layer w0.254: v1(21.17,37.05) 21.17,39.3 24.19,42.32 24.19,47.1 25.42,48.32 25.42,50.32 24.9,50.84
BO1: length 7.5
  Top Layer w0.762: MOTORB1.1 15.48,47.84 15.48,51.1 16.64,52.26 17.8,52.26 17.81,52.25
BO2: length 4.1
  Top Layer w0.762: MOTORB1.2 20.29,47.58 18.16,49.71 17.81,49.71
IIC_SCL: length 20.1
  Top Layer w0.152: U4.45 22.58,23.68 22.39,23.86 21.93,23.86 v1(21.87,23.81)
  Bottom Layer w0.152: J1.3 15.43,34.96 15.91,34.48 15.91,32.86 16.43,32.35 21.55,32.35 21.96,31.94 v1(21.87,23.81)
IIC_SDA: length 23.6
  Top Layer w0.152: U4.46 23.76,23.16 22.39,23.16 22.2,22.97 ; 22.23,23.13 22.23,23
  Bottom Layer w0.152: J1.4 15.36,37.5 16.32,36.54 16.32,33.11 16.75,32.68 21.81,32.68 22.37,32.12 22.37,24.68 22.54,24.5 22.54,23.41 22.26,23.12 ; v1(22.19,23.03) 22.26,23.1 22.26,23.12 ; 22.26,23.12 22.18,23.04
INPUT1: length 26.8
  Top Layer w0.152: U4.41 22.75,25.68 22.56,25.88 18.59,25.88 17.64,24.93 17.64,19.52 27.98,9.18 H4.1
INPUT2: length 26.3
  Top Layer w0.152: U4.40 18.41,26.18 17.31,25.08 17.31,19.24 25.62,10.93 H4.2
INPUT3: length 26
  Top Layer w0.152: H4.3 23.08,12.76 23.1,12.79 23.08,12.79 16.96,18.91 16.96,25.21 18.43,26.68 U4.39
INPUT4: length 25.7
  Top Layer w0.152: H4.4 20.54,14.69 16.65,18.58 16.65,25.41 18.42,27.18 U4.38
INPUT5: length 25.7
  Top Layer w0.152: 30.78,29.18 30.85,29.11 30.85,26.83 31,26.68 31,26 30.84,25.83 v1(30.84,25.74)
  Bottom Layer w0.152: H4.5 18,13.07 30.66,25.74 v1(30.84,25.74) 30.84,25.77 30.77,25.84
INPUT6: length 26.4
  Top Layer w0.152: 30.28,29.18 30.34,29.12 30.34,27.55 30.54,27.34 30.54,26.71 30.39,26.55 v1(30.39,26.45)
  Bottom Layer w0.152: v1(30.39,26.45) 30.34,26.41 30.34,26.08 15.48,11.23 15.48,9.21 H4.6
INPUT7: length 28.1
  Top Layer w0.152: U4.27 29.83,29.13 ; 29.78,29.18 29.78,28.13 29.94,27.98 29.94,27.24 v1(29.83,27.14)
  Bottom Layer w0.152: H4.7 12.89,9.21 12.89,10.71 13.41,11.22 14.9,11.22 29.74,26.06 29.74,27.05 v1(29.83,27.14)
INPUT8: length 29.9
  Top Layer w0.152: v1(29.27,27.72) 29.27,29.17 29.28,29.18
  Bottom Layer w0.152: H4.8 10.38,10.76 11.34,11.72 14.82,11.72 29.27,26.18 v1(29.27,27.72)
LED1: length 36.1
  Top Layer w0.254: 46.82,8.92 45.69,8.92 v1(45.61,9) ; 26.78,29.18 26.78,26.99 29.73,24.04 v1(29.73,22.11)
  Bottom Layer w0.254: v1(29.73,22.11) 34.25,22.11 37.58,18.78 37.58,9.87 38.44,9 v1(45.61,9)
LED2: length 13.7
  Top Layer w0.254: U4.13 32.28,21.25 v1(32.26,21.23) ; R1.1 32.26,9.08 v1(32.26,10.19)
  Bottom Layer w0.254: v1(32.26,10.19) 32.26,10.71 32.9,11.36 32.9,12.32 32.26,12.97 v1(32.26,21.23)
M_PWM1: length 9.1
  Top Layer w0.152: 23.2,34.17 25.14,34.17 25.39,33.92 25.39,31.69 25.78,31.29 27.31,31.29 28.28,30.32 28.28,29.18
M_PWM2: length 11.2
  Top Layer w0.152: 23.2,36.12 25.35,36.12 25.72,35.75 25.72,32.22 26.33,31.61 27.57,31.61 28.78,30.4 28.78,29.18
M_PWM3: length 14.5
  Top Layer w0.152: U3.12 19.13,34.82 19.62,34.33 19.62,31.53 20.58,30.58 26.9,30.58 27.28,30.2 27.28,29.18
M_PWM4: length 16.9
  Top Layer w0.152: 27.78,29.18 27.78,30.22 27.03,30.97 20.77,30.97 20.05,31.69 20.05,36.28 19.57,36.77 U3.9
S_PWM1: length 26.8
  Top Layer w0.152: U4.16 33.8,23.68 34.11,23.37 35.68,23.37 39.47,19.58 47.36,19.58 47.55,19.39 47.55,17.23 48.13,16.65 48.13,12.43 49.93,10.64
S_PWM2: length 24.7
  Top Layer w0.152: U4.17 32.29,24.19 33.72,24.19 34.23,23.68 35.8,23.68 39.6,19.88 47.49,19.88 47.85,19.52 47.85,17.36 48.57,16.64 48.57,14.53 49.93,13.18
S_PWM3: length 22.6
  Top Layer w0.152: 49.93,15.72 48.16,17.48 48.16,19.64 47.62,20.19 39.73,20.19 35.91,24 34.34,24 33.66,24.68 U4.18
S_PWM4: length 20.5
  Top Layer w0.152: 49.93,18.26 49.93,18.31 47.74,20.49 39.85,20.49 36.04,24.31 34.47,24.31 33.59,25.18 U4.19
S_PWM5: length 19.9
  Top Layer w0.152: U4.21 34.59,26.18 39.98,20.8 49.93,20.8
S_PWM6: length 21
  Top Layer w0.152: H1.6 49.78,23.13 47.75,21.1 40.11,21.1 34.56,26.64 32.32,26.64 U4.22
SW1: length 44.9
  Top Layer w0.152: 32.28,22.68 31.32,22.68 30.72,23.28 30.72,24.35 v1(27.78,27.29)
  Top Layer w0.203: C20.1 7.68,42.31 7.68,42.97 8.06,43.36 11.48,43.36 11.81,43.03 v1(11.81,38.19)
  Top Layer w0.254: SW2.2 7.43,42.32 C20.1
  Bottom Layer w0.152: v1(11.81,38.19) 11.87,38.13 12.68,38.13 13.4,38.85 14.9,38.85 16.85,36.89 16.85,33.31 17.08,33.08 21.98,33.08 23.03,32.04 23.03,30.14 23.54,29.63 27.6,29.63 27.78,29.45 v1(27.78,27.29)
SW2: length 40.7
  Top Layer w0.152: v1(28.67,27.24) 28.67,26.89 31.08,24.47 31.08,23.54 31.41,23.18 U4.15
  Top Layer w0.203: 7.48,38.75 v1(7.48,37.42)
  Top Layer w0.254: SW1.2 7.5,38.77 C21.1
  Bottom Layer w0.152: v1(28.67,27.24) 28.67,29.55 28.28,29.93 23.92,29.93 23.43,30.42 23.43,32.19 22.24,33.39 17.97,33.39 17.46,33.9 17.46,37.2 15.43,39.23 13.1,39.23 12.64,38.77 10.84,38.77 9.49,37.42 v1(7.48,37.42)
SWCLK: length 20.5
  Top Layer w0.152: 4.18,25.47 16.1,25.47 18.31,27.68 U4.37
SWDIO: length 24
  Top Layer w0.152: 26.28,29.18 26.28,30.01 26.03,30.26 19.97,30.26 17.68,27.97 4.18,27.97
U1_RX: length 27.5
  Top Layer w0.152: 20.5,25.16 20.5,25.09 20.87,24.73 23.73,24.73 U4.43 ; UART.3 5.32,15.48 7.61,15.48 8.52,16.39 8.52,23.92 v1(8.47,23.97)
  Bottom Layer w0.152: v1(8.47,23.97) 15.99,23.97 16.02,23.99 19.73,23.99 20.38,24.65 20.38,25.11 20.39,25.11 v1(20.39,25.16) 20.39,25.16 20.5,25.16
U1_TX: length 28.9
  Top Layer w0.152: 23.78,25.18 23.75,25.21 21.5,25.21 21.29,25.42 21.29,25.36 v1(21.23,25.29) ; UART.4 8.21,14.25 9.08,15.13 9.08,23.3 v1(9.11,23.33)
  Bottom Layer w0.152: v1(21.23,25.29) 21.23,23.74 20.81,23.33 v1(9.11,23.33)
$1N129: length 2.4
  Top Layer w0.254: D_BOOT.2 35.84,5.4 R3.2
$1N134: length 2.2
  Top Layer w0.254: D_PWR.2 39.49,5.23 R4.2
$1N167: length 6.8
  Top Layer w0.152: U4.9 29.28,19.52 29.68,19.11 30.77,19.11 31.69,18.2 32.54,18.2
  Top Layer w0.381: 32.54,18.2 32.47,18.14 32.47,16.42
$1N215: length 6.7
  Top Layer w0.254: 27.78,20.68 27.78,16.87 27.98,16.67 27.98,16.51
  Top Layer w0.381: 30.31,16.23 30.03,16.51 27.98,16.51
$1N216: length 8.7
  Top Layer w0.254: X1.3 26.89,15.92 26.89,17.59 27.28,17.98 U4.5
  Top Layer w0.381: X1.3 C6.2
$1N257: length 3.7
  Top Layer w0.152: R7.1 21.2,24.04 21.55,24.4 22.47,24.4 22.68,24.18 U4.44
$1N262: length 9.5
  Top Layer w0.152: 35.57,30.04 35.57,28.79 35.24,28.46 34.63,28.46 34.28,28.11 34.28,27.42 ; v1(34.26,25.61) 34.19,25.68 34.06,25.68 ; 34.06,25.68 32.28,25.68 32.28,25.68 ; 34.06,25.68 U4.20 ; 34.06,25.68 34.06,25.68 ; 34.28,27.42 34.28,27.31 v1(34.32,27.36) 34.32,27.38 34.28,27.42
  Inner2 w0.152: 34.28,25.46 34.28,25.63 ; 34.28,25.63 v1(34.26,25.61) ; 34.28,25.63 34.28,27.27 34.32,27.31 v1(34.32,27.36)
$1N295: length 8.5
  Top Layer w0.152: U4.7 28.28,19.17 28.97,18.48 30.8,18.48 31.33,17.94 31.33,15.99 31.96,15.36 R15.1
$1N540: length 2.4
  Top Layer w0.254: R19.2 46.82,5.06
$1N717: length 2.3
  Top Layer w0.254: 43.29,5.22 43.29,7.25 R11.2
$1N960: length 2.8
  Top Layer w0.254: D_ERR.2 32.19,4.77 R1.2
$2N12: length 10.8
  Top Layer w0.254: U5.8 46.98,37.52 47.56,37.52 47.86,37.83 47.86,40.19 48.72,41.05 R17.1
  Top Layer w0.381: R17.1 51.33,41.1 C15.2 51.35,42.85 51.35,44.55
$2N96: length 6.2
  Top Layer w0.381: 45.78,33.2 45.78,33.81 51.4,33.81
$2N110: length 1.9
  Top Layer w0.254: C22.2 52.8,35.65 52.78,35.67
$2N111: length 4.4
  Top Layer w0.254: U5.5 46.98,35.67 51.27,35.67
$2N134: length 5.9
  Top Layer w0.254: 51.33,39.26 50.21,39.26 49.54,38.59 49.54,37.6 48.9,36.96 46.97,36.96 U5.7
$2N158: length 4.8
  Top Layer w0.254: R20.1 50.17,37.47 48.98,36.28 U5.6
$3N90: length 9.6
  Top Layer w0.254: R12.1 18.11,47.31 16.19,49.23 16.19,50.52 16.58,50.9 17.73,50.9 17.81,50.98
$3N100: length 11.5
  Top Layer w0.254: 35.48,50.57 39.43,50.57 40.17,49.83 40.17,43.36

## Copper pours and planes (outline as drawn; the poured copper is in the pictures)
3V3 on Inner2: 28.83,38.95 36.43,33.79 36.43,19.27 47.86,19.29 47.88,1.16 7.44,1.13 7.44,10.63 7.42,10.6 0.1,10.6 0.43,10.93 0.43,39.15
+6.8V on Top Layer: 41.29,29.03 53.87,29.03 53.87,9.42 41.29,9.42
GND on Top Layer: 54.13,24.78 56.38,24.78 56.38,9.47 54.13,9.47
GND on Top Layer: -6.61,57.3 -6.48,57.17 -6.48,-8.11 -5.97,-7.6 74.16,-7.6 73.78,-7.22 73.78,57.81
GND on Bottom Layer: -7.16,62.28 -7.54,61.9 -7.54,-6.81 -6.14,-5.41 72.6,-5.41 73.36,-4.65 73.36,62.15 72.98,62.53 -5.51,62.53
GND on Inner1: 8.94,6.92 10.77,6.92 10.77,6.13 8.94,6.13
GND on Inner1: 22.68,7.97 23.47,7.97 23.47,6.13 22.68,6.13
GND on Inner1: 16.56,6.92 18.39,6.92 18.39,6.13 16.56,6.13
GND on Inner1: 22.68,6.92 24.52,6.92 24.52,6.13 22.68,6.13
GND on Inner1: 53.67,13.67 55.5,13.67 55.5,12.88 53.67,12.88
GND on Inner1: 54.71,18.75 55.51,18.75 55.51,16.91 54.71,16.91
GND on Inner1: 12.75,32.82 14.58,32.82 14.58,32.03 12.75,32.03
GND on Inner1: 12.52,6.92 13.31,6.92 13.31,5.09 12.52,5.09
GND on Inner1: 20.14,6.92 21.98,6.92 21.98,6.13 20.14,6.13
GND on Inner1: 27.76,6.92 29.6,6.92 29.6,6.13 27.76,6.13
GND on Inner1: 54.71,16.21 55.51,16.21 55.51,14.37 54.71,14.37
GND on Inner1: 30.95,44.87 32.45,44.87 32.45,41.61 30.95,41.61
GND on Inner1: 53.67,23.83 55.5,23.83 55.5,23.04 53.67,23.04
GND on Inner1: 54.71,23.83 55.51,23.83 55.51,21.99 54.71,21.99
GND on Inner1: 15.06,7.97 15.85,7.97 15.85,6.13 15.06,6.13
GND on Inner1: 54.71,14.71 55.51,14.71 55.51,12.88 54.71,12.88
GND on Inner1: 25.22,7.97 26.01,7.97 26.01,6.13 25.22,6.13
GND on Inner1: 12.52,6.92 14.36,6.92 14.36,6.13 12.52,6.13
GND on Inner1: 9.98,6.92 11.82,6.92 11.82,6.13 9.98,6.13
GND on Inner1: 13.79,33.86 14.58,33.86 14.58,32.03 13.79,32.03
GND on Inner1: 15.06,6.92 15.85,6.92 15.85,5.09 15.06,5.09
GND on Inner1: 53.67,18.75 55.5,18.75 55.5,17.96 53.67,17.96
GND on Inner1: 0.08,56.57 56.5,56.57 56.5,0.08 0.08,0.08
GND on Inner1: 14.02,6.92 15.85,6.92 15.85,6.13 14.02,6.13
GND on Inner1: 54.71,21.29 55.51,21.29 55.51,19.45 54.71,19.45
GND on Inner1: 11.48,6.92 13.31,6.92 13.31,6.13 11.48,6.13
GND on Inner1: 9.98,6.92 10.77,6.92 10.77,5.09 9.98,5.09
GND on Inner1: 12.52,7.97 13.31,7.97 13.31,6.13 12.52,6.13
GND on Inner1: 9.98,7.97 10.77,7.97 10.77,6.13 9.98,6.13
GND on Inner1: 19.1,6.92 20.93,6.92 20.93,6.13 19.1,6.13
GND on Inner1: 27.76,7.97 28.55,7.97 28.55,6.13 27.76,6.13
GND on Inner1: 17.6,6.92 19.44,6.92 19.44,6.13 17.6,6.13
GND on Inner1: 27.76,6.92 28.55,6.92 28.55,5.09 27.76,5.09
GND on Inner1: 13.79,32.82 15.63,32.82 15.63,32.03 13.79,32.03
GND on Inner1: 54.71,17.25 55.51,17.25 55.51,15.42 54.71,15.42
GND on Inner1: 20.14,6.92 20.93,6.92 20.93,5.09 20.14,5.09
GND on Inner1: 30.95,46.63 32.45,46.63 32.45,43.37 30.95,43.37
GND on Inner1: 53.67,21.29 55.5,21.29 55.5,20.5 53.67,20.5
GND on Inner1: 15.06,6.92 16.9,6.92 16.9,6.13 15.06,6.13
GND on Inner1: 54.71,19.79 55.51,19.79 55.51,17.96 54.71,17.96
GND on Inner1: 30.95,44.87 34.21,44.87 34.21,43.37 30.95,43.37
GND on Inner1: 53.67,11.13 55.5,11.13 55.5,10.34 53.67,10.34
GND on Inner1: 54.71,24.87 55.51,24.87 55.51,23.04 54.71,23.04
GND on Inner1: 53.67,16.21 55.5,16.21 55.5,15.42 53.67,15.42
GND on Inner1: 25.22,6.92 26.01,6.92 26.01,5.09 25.22,5.09
GND on Inner1: 17.6,7.97 18.39,7.97 18.39,6.13 17.6,6.13
GND on Inner1: 21.64,6.92 23.47,6.92 23.47,6.13 21.64,6.13
GND on Inner1: 20.14,7.97 20.93,7.97 20.93,6.13 20.14,6.13
GND on Inner1: 26.72,6.92 28.55,6.92 28.55,6.13 26.72,6.13
GND on Inner1: 54.71,12.17 55.51,12.17 55.51,10.34 54.71,10.34
GND on Inner1: 13.79,32.82 14.58,32.82 14.58,30.98 13.79,30.98
GND on Inner1: 24.18,6.92 26.01,6.92 26.01,6.13 24.18,6.13
GND on Inner1: 25.22,6.92 27.06,6.92 27.06,6.13 25.22,6.13
GND on Inner1: 54.71,22.33 55.51,22.33 55.51,20.5 54.71,20.5
GND on Inner1: 17.6,6.92 18.39,6.92 18.39,5.09 17.6,5.09
GND on Inner1: 54.71,11.13 55.51,11.13 55.51,9.29 54.71,9.29
GND on Inner1: 54.71,13.67 55.51,13.67 55.51,11.83 54.71,11.83
GND on Inner1: 22.68,6.92 23.47,6.92 23.47,5.09 22.68,5.09
GND on Inner1: 29.19,44.87 32.45,44.87 32.45,43.37 29.19,43.37
VIN on Top Layer: 25.1,48.45 36.45,48.45 36.45,35.94 25.1,35.94
VIN on Top Layer: 35.8,38.13 44.94,38.13 44.94,35.94 35.8,35.94
$2N96 on Top Layer: 41.44,36.53 45.98,36.53 45.98,31.1 41.44,31.1

Small or netless copper shapes (teardrops, artwork), in the pictures only: 418 on Top Layer, 35 on Bottom Layer, 12 on Inner2

## Text on the board
Bottom Silkscreen Layer: Metry | Yuri 2022 5
Top Silkscreen Layer: YuriPre | 前置协处理器
